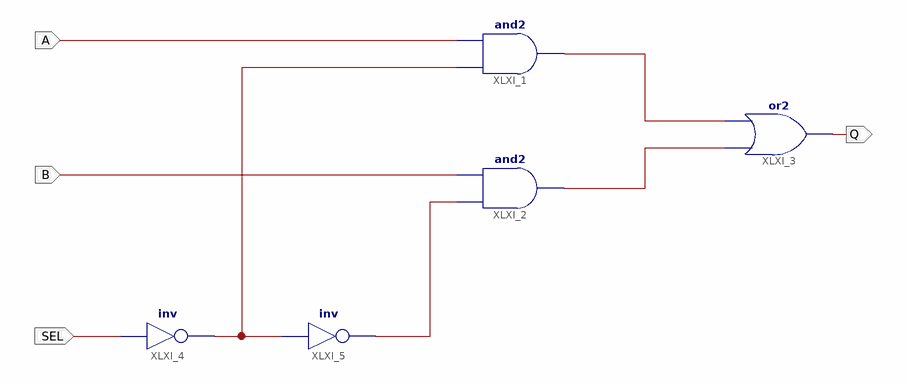
[diagram p0: schematic sheet 1]
// Xilinx ISE schematic data_selector.sch (artix7) as structural Verilog: 5 symbols, 4 ports
module data_selector (
  input  A,
  input  B,
  input  SEL,
  output Q
);

  wire XLXN_1, XLXN_3, XLXN_4, XLXN_5;

  and XLXI_2 (XLXN_3, XLXN_5, B);
  or XLXI_3 (Q, XLXN_3, XLXN_1);
  not XLXI_4 (XLXN_4, SEL);
  not XLXI_5 (XLXN_5, XLXN_4);
  and XLXI_1 (XLXN_1, XLXN_4, A);
endmodule
